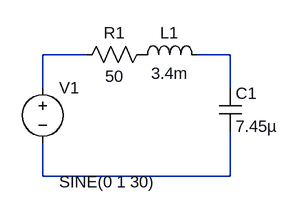
[diagram p0: schematic Task3b.asc]
Task3b.asc, the LTspice schematic file:
Version 4
SHEET 1 880 680
WIRE 208 80 144 80
WIRE 416 80 368 80
WIRE 144 128 144 80
WIRE 416 128 416 80
WIRE 144 256 144 208
WIRE 416 256 416 192
WIRE 416 256 144 256
SYMBOL voltage 144 112 R0
WINDOW 3 24 152 Left 2
WINDOW 123 24 124 Left 2
WINDOW 39 0 0 Left 0
SYMATTR InstName V1
SYMATTR Value SINE(0 1 30)
SYMBOL res 304 64 R90
WINDOW 0 0 56 VBottom 2
WINDOW 3 32 56 VTop 2
SYMATTR InstName R1
SYMATTR Value 50
SYMBOL ind 272 96 R270
WINDOW 0 32 56 VTop 2
WINDOW 3 5 56 VBottom 2
SYMATTR InstName L1
SYMATTR Value 3.4m
SYMBOL cap 400 128 R0
SYMATTR InstName C1
SYMATTR Value 7.45µ

The netlist it stands for:
* Task3b.asc
V1 N001 N003 SINE(0 1 30)
R1 P001 N001 50
L1 P001 N002 3.4m
C1 N002 N003 7.45µ
.backanno
.end